# EAGLE design CANBusBorad (EAGLE 9.6.2)
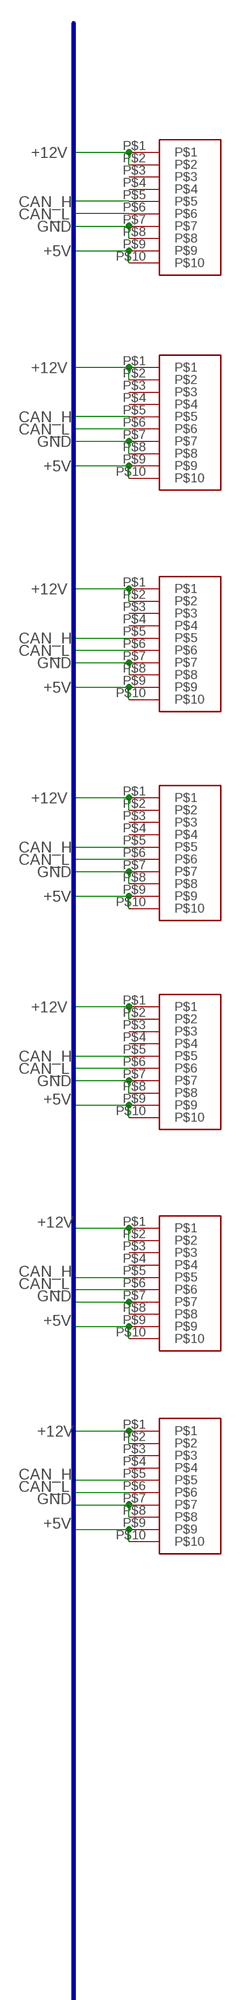
[diagram p0: schematic, sheet 1, part 1 of 2]
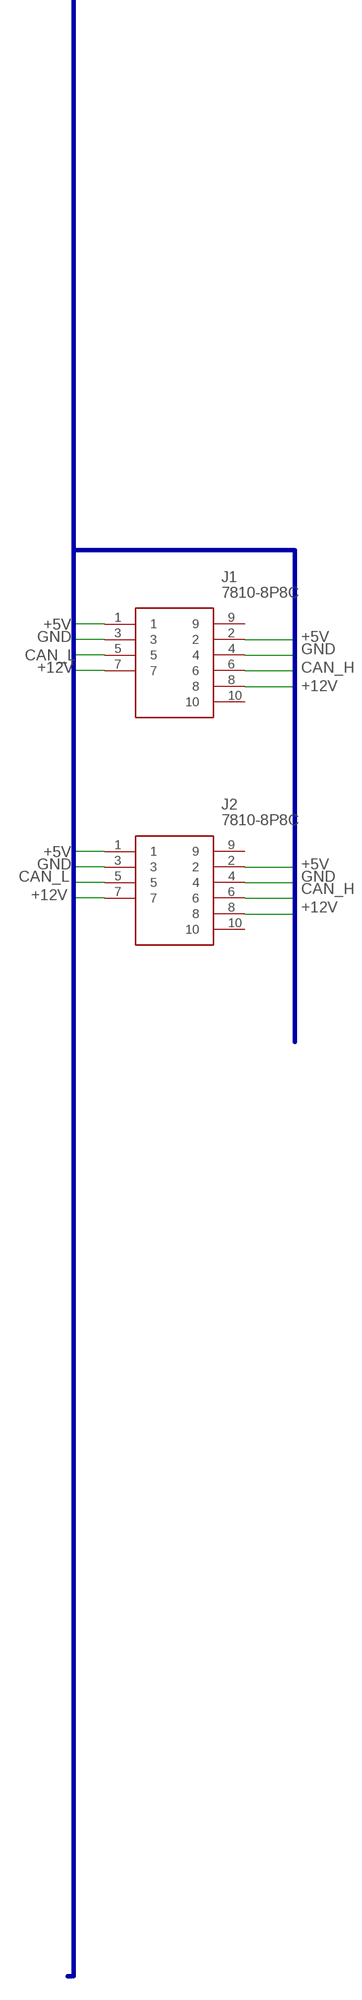
[diagram p1: schematic, sheet 1, part 2 of 2]

## Parts
CON1  FH-2X5SG/RH  [BOX10P_SOCKET]
CON2  FH-2X5SG/RH  [BOX10P_SOCKET]
CON3  FH-2X5SG/RH  [BOX10P_SOCKET]
CON4  FH-2X5SG/RH  [BOX10P_SOCKET]
CON5  FH-2X5SG/RH  [BOX10P_SOCKET]
CON6  FH-2X5SG/RH  [BOX10P_SOCKET]
CON7  FH-2X5SG/RH  [BOX10P_SOCKET]
J1  7810-8P8C  [78108P8C]
J2  7810-8P8C  [78108P8C]

## Nets
+5V: CON1.P$9 CON1.P$10 CON2.P$9 CON2.P$10 CON3.P$9 CON3.P$10 CON4.P$9 CON4.P$10 CON5.P$9 CON5.P$10 CON6.P$9 CON6.P$10 CON7.P$9 CON7.P$10 J1.1 J1.2 J2.1 J2.2
+12V: CON1.P$1 CON1.P$2 CON2.P$1 CON2.P$2 CON3.P$1 CON3.P$2 CON4.P$1 CON4.P$2 CON5.P$1 CON5.P$2 CON6.P$1 CON6.P$2 CON7.P$1 CON7.P$2 J1.7 J1.8 J2.7 J2.8
CAN_H: CON1.P$5 CON2.P$5 CON3.P$5 CON4.P$5 CON5.P$5 CON6.P$5 CON7.P$5 J1.6 J2.6
CAN_L: CON1.P$6 CON2.P$6 CON3.P$6 CON4.P$6 CON5.P$6 CON6.P$6 CON7.P$6 J1.5 J2.5
GND: CON1.P$7 CON1.P$8 CON2.P$7 CON2.P$8 CON3.P$7 CON3.P$8 CON4.P$7 CON4.P$8 CON5.P$7 CON5.P$8 CON6.P$7 CON6.P$8 CON7.P$7 CON7.P$8 J1.3 J1.4 J2.3 J2.4
Unconnected: CON1.P$3 CON1.P$4 CON2.P$3 CON2.P$4 CON3.P$3 CON3.P$4 CON4.P$3 CON4.P$4 CON5.P$3 CON5.P$4 CON6.P$3 CON6.P$4 CON7.P$3 CON7.P$4 J1.9 J1.10 J2.9 J2.10

## Buses
+5V,+12V,CAN_H,CAN_L,GND

## Library data of the parts
CON1-CON7 = FH-2X55G:RH:FH-2X5SG/RH
J1 J2 = 7810-8P8C:7810-8P8C: Modular Jack, side entry, shielded Source: Datasheet <http://akizukidenshi.com/download/ds/neltron/7810-XPXC_20180312.pdf>; DESCRIPTION: Modular Jack, side entry, shielded; HEIGHT: 14.75mm; MANUFACTURER_NAME: NELTRON; MANUFACTURER_PART_NUMBER: 7810-8P8C

## Board
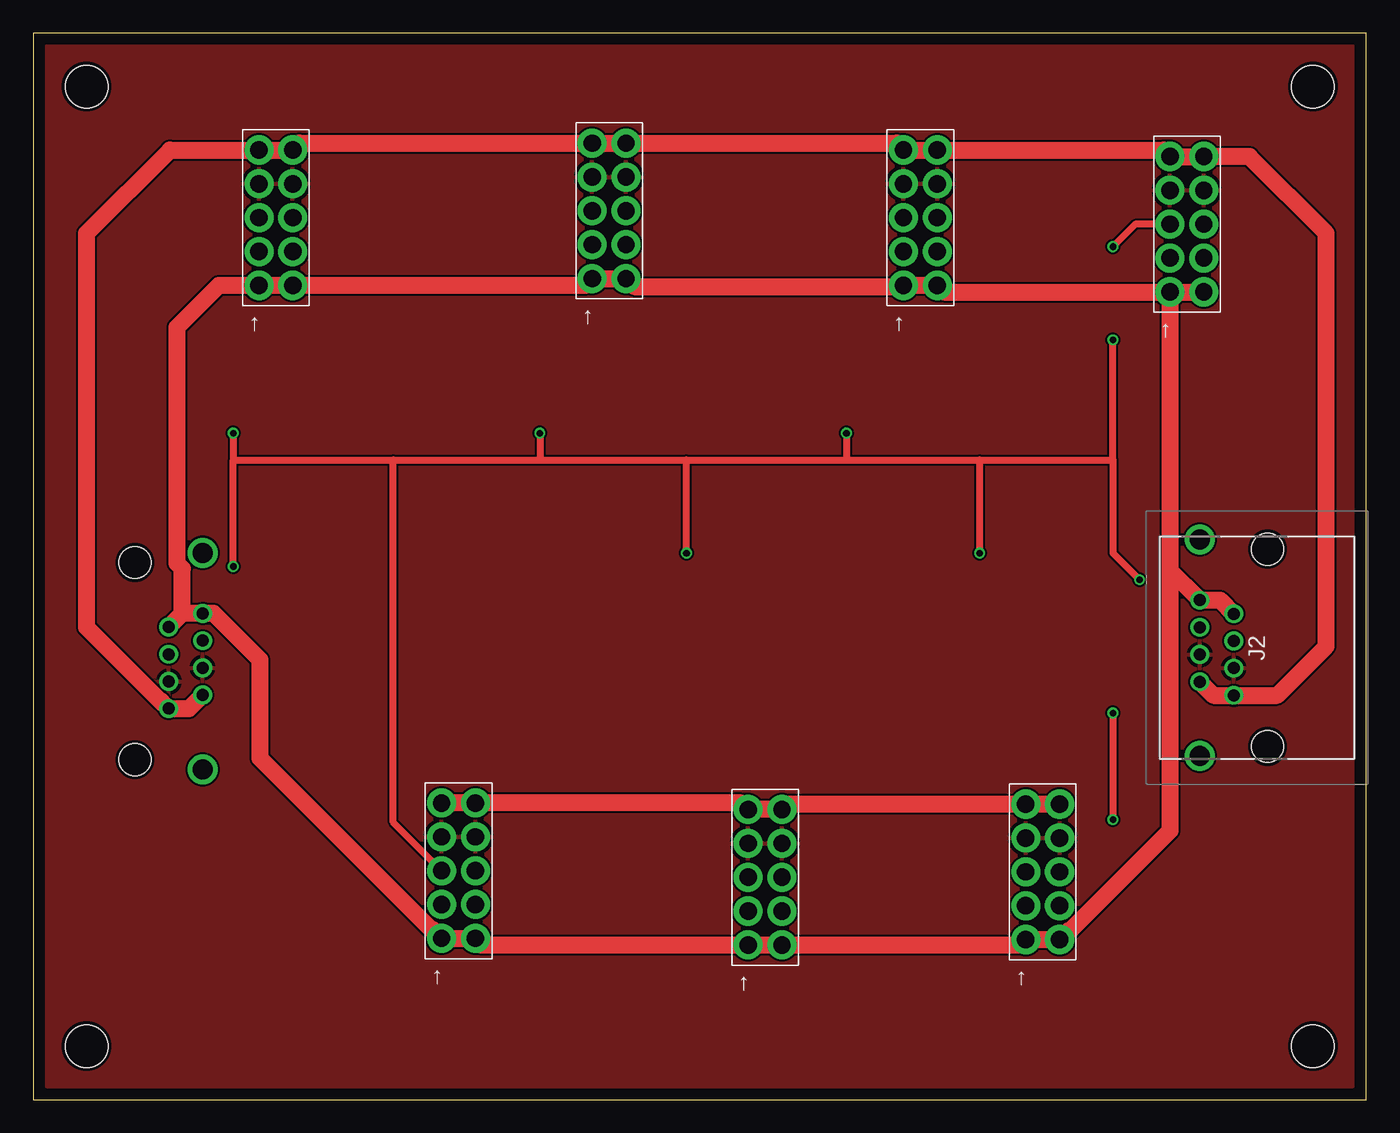
[diagram p2: board, top side]
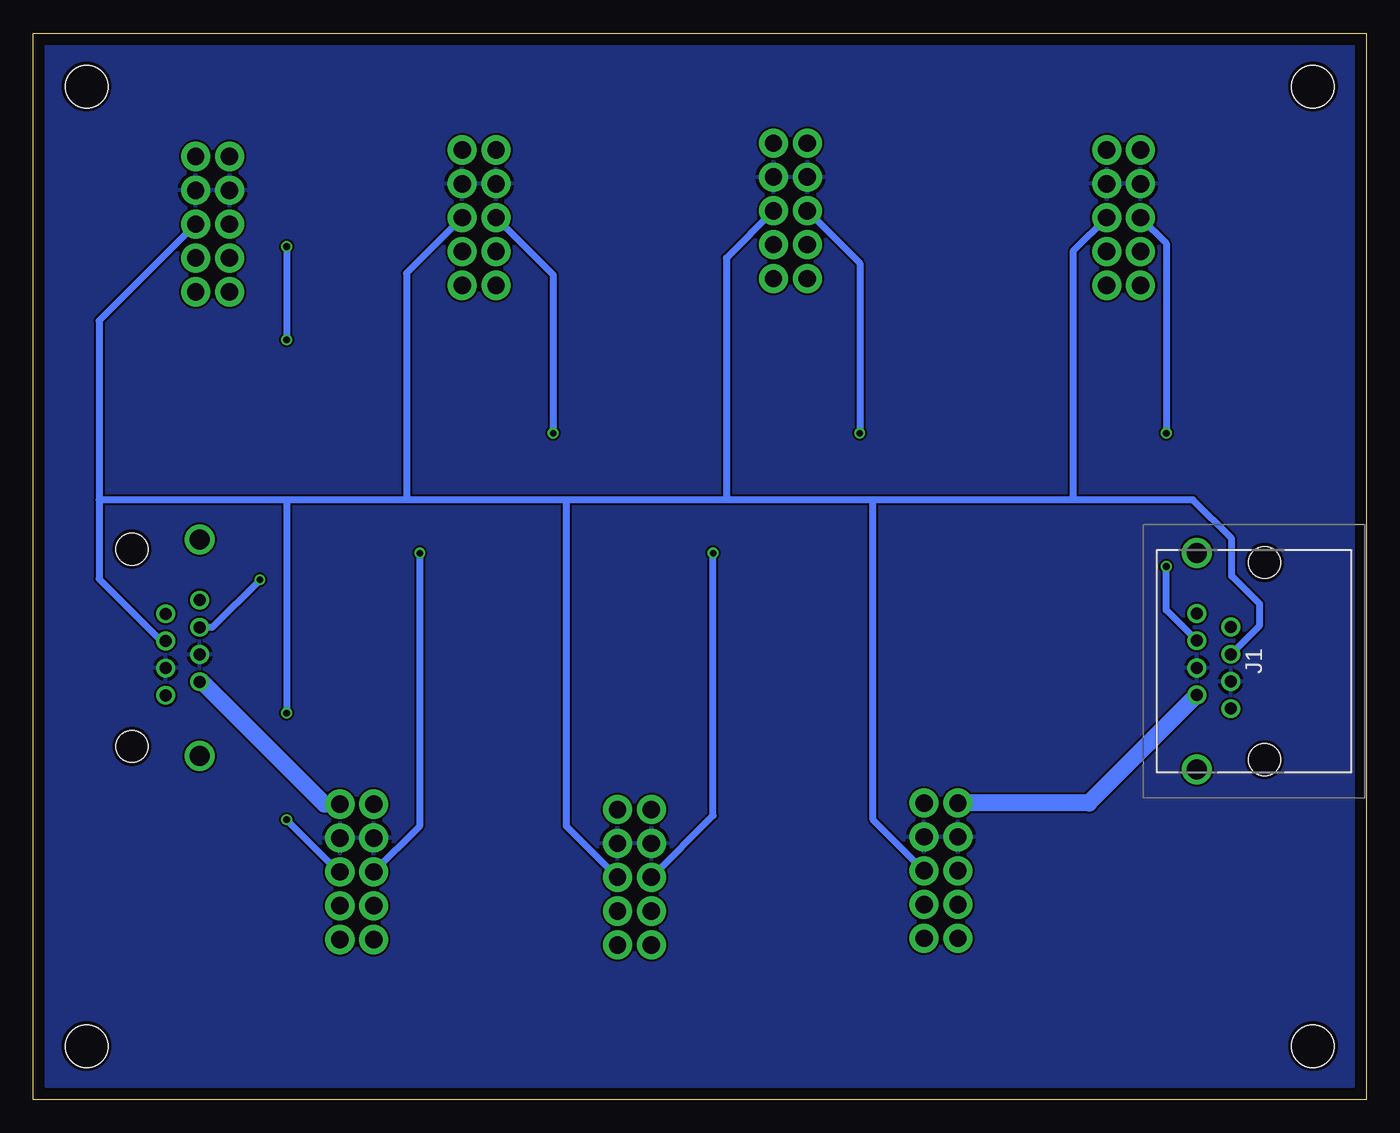
[diagram p3: board, bottom side, seen from below]

Size 100 x 80 mm. Coordinates in mm from the lower left corner, seen from the top.
Outline: 0,0 100,0 100,80 0,80 0,0
Copper layers (1*16): Top 0.035mm / dielectric 1.5mm / Bottom 0.035mm
Design rules "SeeedStudio_2layer_DRU_no_angle_20140221": minimum track width 6mil, minimum drill 12mil, track to track 6mil, track to pad 6mil, pad to pad 6mil, via to via 6mil, smd to smd 0mil, copper to edge 10mil, drill to drill 10mil, minimum pad ring 10mil, minimum via ring 6mil, stop-mask expansion 2mil, vias tented up to drill 100mil, thermal gap 10mil
Holes 3.2 mm at 4,4 4,76 96,4 96,76

### Footprints (pad centres in the part's own frame; a part is rotated, then mirrored left to right if it is on the bottom)
BOX10P_SOCKET = drill 1.3 pad 2.184: P$1 0,2.54; P$2 0,0; P$3 2.54,2.54; P$4 2.54,0; P$5 5.08,2.54; P$6 5.08,0; P$7 7.62,2.54; P$8 7.62,0; P$9 10.16,2.54; P$10 10.16,0
78108P8C = drill 0.9 pad 1.4: 1 0,0; 2 1.02,2.54; 3 2.04,0; 4 3.06,2.54; 5 4.08,0; 6 5.1,2.54; 7 6.12,0; 8 7.14,2.54 | drill 1.5 pad 2.25: 9 -4.555,2.54; 10 11.695,2.54 | hole 2.4: -3.83,-2.54; 10.97,-2.54

### Placement (x,y rotation side)
CON1  56.17,11.6 90 top
CON2  33.17,12.09 90 top
CON3  87.82,60.6 90 top
CON4  67.82,61.09 90 top
CON5  44.47,61.6 90 top
CON6  19.47,61.09 90 top
CON7  77,12 90 top
J1  10.16,29.33 90 bottom
J2  90.06,30.33 90 top

### Tracks (layer width: path | path; a pad name or v marks a point on that pad's centre or on a via)
+5V
  Top 1.27: J1.2 11.68,29.33 J1.1 9.61,29.88 9.54,29.88 4,35.42 4,65 10.25,71.25 CON6.P$9 CON6.P$10 19.98,71.76 CON5.P$9 CON5.P$10 64.77,71.76 CON4.P$9 CON4.P$10 84.79,71.25 CON3.P$9 CON3.P$10 91.24,70.76 97,65 97,34 93.33,30.33 J2.1 88.54,30.33 J2.2 | CON7.P$10 CON7.P$9 56.57,22.16 CON1.P$10 CON1.P$9 53.14,22.25 CON2.P$10 CON2.P$9
  Bottom 1.27: J2.2 87.35,31.35 78.16,22.16 CON7.P$10 | J1.2 20.8,22.25 CON2.P$9
+12V
  Top 1.27: J1.7 11.18,36.47 | 11.18,36.47 J1.8 13.53,36.47 17,33 17,25.6 29.85,12.75 29.97,12.75 CON2.P$1 CON2.P$2 33.66,11.6 CON1.P$1 CON1.P$2 74.06,11.6 CON7.P$1 CON7.P$2 77.66,12.66 77.78,12.66 85.28,20.16 85.28,39.71 | CON3.P$1 68.31,60.6 CON4.P$2 CON4.P$1 65.19,61 45.07,61 CON5.P$2 CON5.P$1 41.42,61.09 CON6.P$2 CON6.P$1 13.93,61.09 10.79,57.95 10.79,40.23 11.18,39.84 11.18,36.47 | CON3.P$1 CON3.P$2 | J2.7 89.04,37.47 J2.8 85.28,39.71 | CON3.P$1 85.28,39.71
CAN_H  (via drill 0.5)
  Top 0.508: v15,50 15,48 | v15,40 15,48 | 15,48 27,48 | 27,48 38,48 | 38,48 49,48 | 49,48 61,48 | 61,48 71,48 | 71,48 81,48 | 81,48 v81,57 | CON3.P$5 82.68,65.68 v81,64 | v38,50 38,48 | v61,50 61,48 | 81,48 81,41 v83,39 | v71,41 71,48 | v49,41 49,48 | CON2.P$5 27,20.8 27,48
  Bottom 0.508: J1.6 15,36.73 v15,40 | CON6.P$5 15,64.24 v15,50 | v81,64 v81,57 | CON5.P$5 38,62.75 v38,50 | CON4.P$5 61,61.89 v61,50 | v83,39 86.57,35.43 J2.6 | CON7.P$5 71,20.54 v71,41 | CON1.P$5 49,21.31 v49,41
CAN_L  (via drill 0.5)
  Top 0.508: v81,29 v81,21
  Bottom 0.508: J1.5 8,35.57 8,37.19 10.09,39.28 10.09,42.09 13,45 22,45 | 22,45 37,45 | 37,45 48,45 | 48,45 60,45 | 60,45 72,45 | 72,45 81,45 | 81,45 95.07,45 | 95.07,45 95.07,39.07 90.41,34.41 J2.5 | CON6.P$6 22,63.64 22,45 | CON5.P$6 48,63.15 48,45 | CON4.P$6 72,61.99 72,45 | CON3.P$6 95.07,58.43 95.07,45 | CON7.P$6 77.08,17.08 v81,21 | 81,45 v81,29 | CON1.P$6 60,20.51 60,45 | CON2.P$6 37,21 37,45
GND
  pour Top: 1,79 1,1 99,1 99,79
  pour Bottom: 1,79 1,1 99,1 99,79